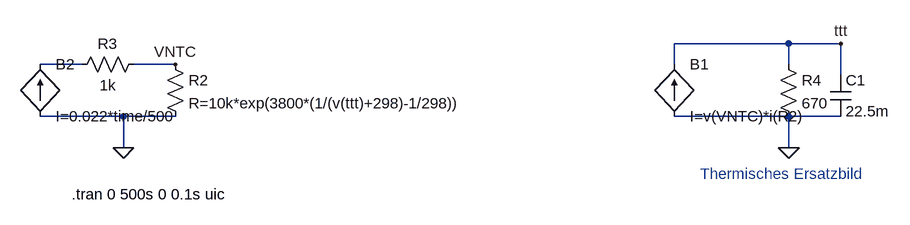
[diagram p0: schematic V3 NTC.asc]
V3 NTC.asc, the LTspice schematic file:
Version 4
SHEET 1 880 680
WIRE 512 -80 336 -80
WIRE 592 -80 512 -80
WIRE -576 -48 -640 -48
WIRE -432 -48 -496 -48
WIRE 336 -48 336 -80
WIRE 512 -48 512 -80
WIRE 592 -32 592 -80
WIRE -512 32 -640 32
WIRE -432 32 -512 32
WIRE 512 32 336 32
WIRE 592 32 512 32
WIRE -512 80 -512 32
WIRE 512 80 512 32
FLAG -512 80 0
FLAG 512 80 0
FLAG 592 -80 ttt
FLAG -432 -48 VNTC
SYMBOL res -448 -64 R0
SYMATTR InstName R2
SYMATTR Value R=10k*exp(3800*(1/(v(ttt)+298)-1/298))
SYMBOL cap 576 -32 R0
SYMATTR InstName C1
SYMATTR Value 22.5m
SYMBOL res -480 -64 R90
WINDOW 0 0 56 VBottom 2
WINDOW 3 32 56 VTop 2
SYMATTR InstName R3
SYMATTR Value 1k
SYMBOL bi2 -640 -48 R0
SYMATTR InstName B2
SYMATTR Value I=0.022*time/500
SYMBOL res 496 -64 R0
SYMATTR InstName R4
SYMATTR Value 670
SYMBOL bi2 336 -48 R0
SYMATTR InstName B1
SYMATTR Value I=v(VNTC)*i(R2)
TEXT -592 152 Left 2 !.tran 0 500s 0 0.1s uic
TEXT 376 120 Left 2 ;Thermisches Ersatzbild

The netlist it stands for:
* V3 NTC.asc
R2 VNTC 0 R=10k*exp(3800*(1/(v(ttt)+298)-1/298))
C1 ttt 0 22.5m
R3 VNTC N001 1k
B2 0 N001 I=0.022*time/500
R4 ttt 0 670
B1 0 ttt I=v(VNTC)*i(R2)
.tran 0 500s 0 0.1s uic
* Thermisches Ersatzbild
.backanno
.end